# Altium project ATM90E3x-DB.PrjPcb
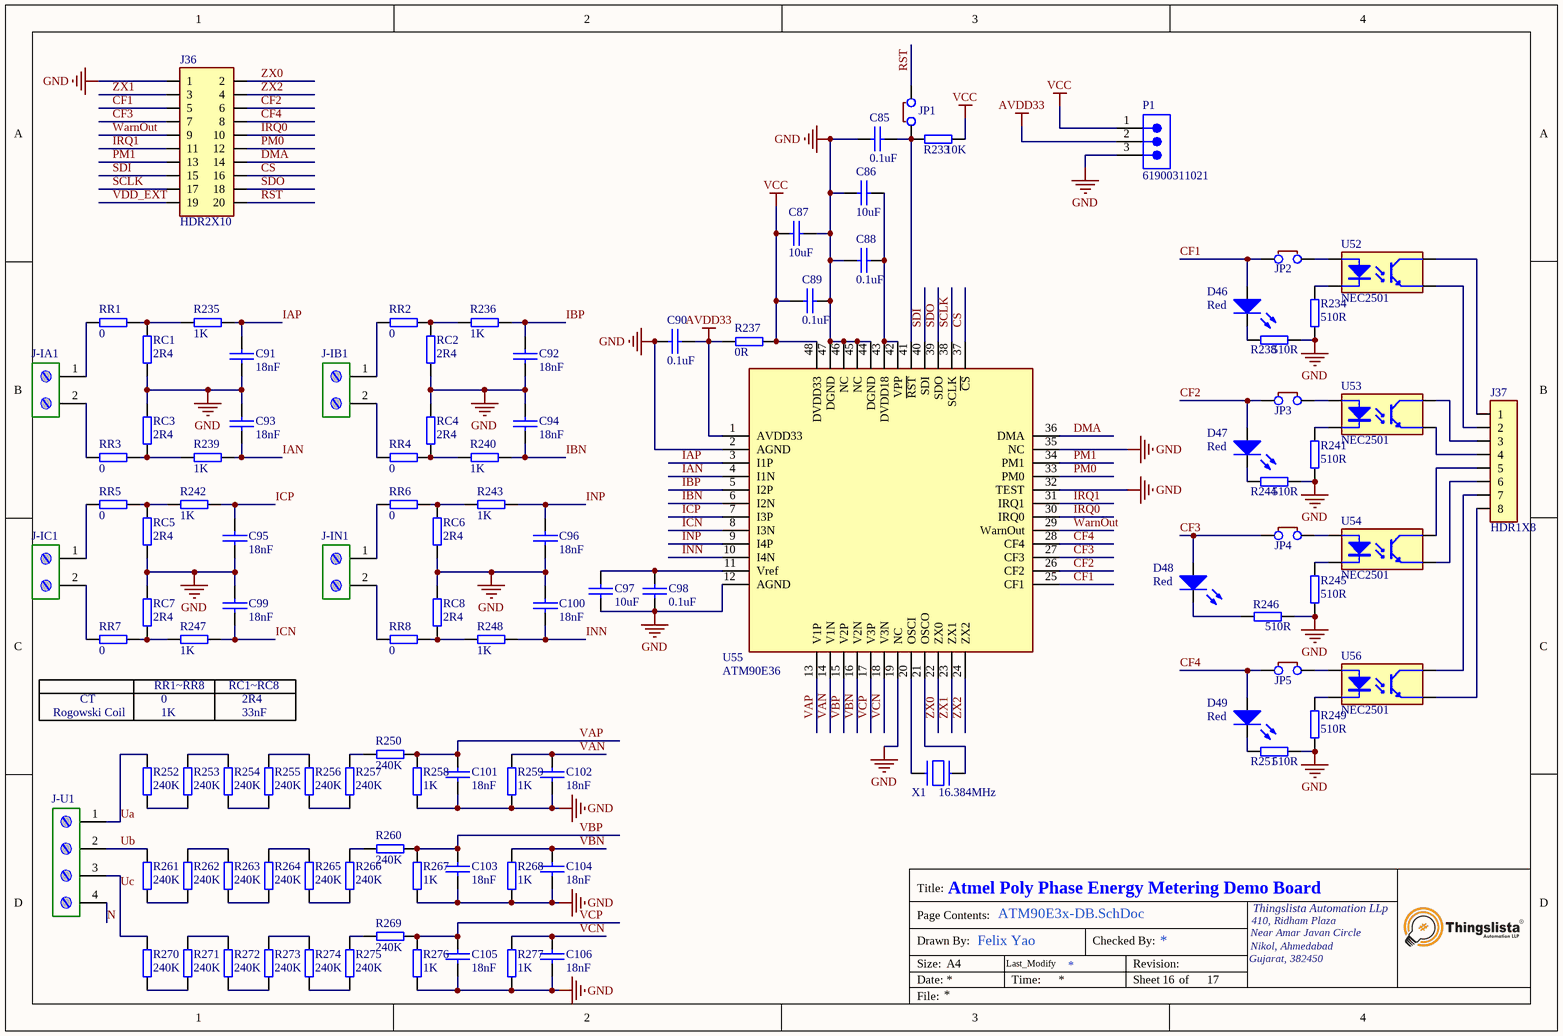
[diagram p0: ATM90E3x-DB.SchDoc]
1 sheet, 106 parts. Net scope: global (net labels, ports and power ports of the same name join across sheets).
Board file: ATM90E3x-DB.PcbDoc

## Sheet ATM90E3x-DB.SchDoc: Atmel Poly Phase Energy Metering Demo Board
size A4; DrawnBy: Felix Yao; Organization: Smart Energy; Revision: 1.0; SheetNumber: 16; SheetTotal: 17; PageSetup: Record=PageOptions|CenterHorizontal=True|CenterVertical=True|PrintScale=0.71|XCorrection=1.00|YCorrection=1.00|PrintKind=1|BorderSize=5000000|LeftOffset=0|BottomOffset=0|Orientation=2|PaperLength=2969|PaperWidth=2100|Scale=100|PaperSource=7|PrintQuality=600|MediaType=1|DitherType=10|PaperKind=A4 (210 x 297 mm)|PrintScaleMode=1

### Parts
C85  0.1uF  [C0603]
C86  10uF  [C0805]
C87  10uF  [C0805]
C88  0.1uF  [C0603]
C89  0.1uF  [C0603]
C90  0.1uF  [C0603]
C91  18nF  [C0805]
C92  18nF  [C0805]
C93  18nF  [C0805]
C94  18nF  [C0805]
C95  18nF  [C0805]
C96  18nF  [C0805]
C97  10uF  [C0805]
C98  0.1uF  [C0603]
C99  18nF  [C0805]
C100  18nF  [C0805]
C101  18nF  [C0805]
C102  18nF  [C0805]
C103  18nF  [C0805]
C104  18nF  [C0805]
C105  18nF  [C0805]
C106  18nF  [C0805]
D46  Red  [LED-0805R]
D47  Red  [LED-0805R]
D48  Red  [LED-0805R]
D49  Red  [LED-0805R]
J36  HDR2X10  [HDR2X10]
J37  HDR1X8  [HDR1X8]
J-IA1  (no value)  [TE-1776119-2]
J-IB1  (no value)  [TE-1776119-2]
J-IC1  (no value)  [TE-1776119-2]
J-IN1  (no value)  [TE-1776119-2]
J-U1  (no value)  [TE-282843-4]
JP1  JMP  [JMP]  (value not drawn)
JP2  JMP  [JMP]  (value not drawn)
JP3  JMP  [JMP]  (value not drawn)
JP4  JMP  [JMP]  (value not drawn)
JP5  JMP  [JMP]  (value not drawn)
P1  61900311021  [61900311021]
R233  10K  [R0603]
R234  510R  [R0805]
R235  1K  [R0805]
R236  1K  [R0805]
R237  0R  [R0603]
R238  510R  [R0805]
R239  1K  [R0805]
R240  1K  [R0805]
R241  510R  [R0805]
R242  1K  [R0805]
R243  1K  [R0805]
R244  510R  [R0805]
R245  510R  [R0805]
R246  510R  [R0805]
R247  1K  [R0805]
R248  1K  [R0805]
R249  510R  [R0805]
R250  240K  [R1206]
R251  510R  [R0805]
R252  240K  [R1206]
R253  240K  [R1206]
R254  240K  [R1206]
R255  240K  [R1206]
R256  240K  [R1206]
R257  240K  [R1206]
R258  1K  [R0805]
R259  1K  [R0805]
R260  240K  [R1206]
R261  240K  [R1206]
R262  240K  [R1206]
R263  240K  [R1206]
R264  240K  [R1206]
R265  240K  [R1206]
R266  240K  [R1206]
R267  1K  [R0805]
R268  1K  [R0805]
R269  240K  [R1206]
R270  240K  [R1206]
R271  240K  [R1206]
R272  240K  [R1206]
R273  240K  [R1206]
R274  240K  [R1206]
R275  240K  [R1206]
R276  1K  [R0805]
R277  1K  [R0805]
RC1  2R4  [R0805]
RC2  2R4  [R0805]
RC3  2R4  [R0805]
RC4  2R4  [R0805]
RC5  2R4  [R0805]
RC6  2R4  [R0805]
RC7  2R4  [R0805]
RC8  2R4  [R0805]
RR1  0  [R0805]
RR2  0  [R0805]
RR3  0  [R0805]
RR4  0  [R0805]
RR5  0  [R0805]
RR6  0  [R0805]
RR7  0  [R0805]
RR8  0  [R0805]
U52  NEC2501  [PS2501L-1]
U53  NEC2501  [PS2501L-1]
U54  NEC2501  [PS2501L-1]
U55  ATM90E36  [TQFP-48(7x7)]
U56  NEC2501  [PS2501L-1]
X1  16.384MHz  [XTAL-MIX-49]

### Nets
AVDD33: C90.2 P1.2 R237.2 U55.1(AVDD33)
GND: C85.1 C86.2 C87.1 C88.1 C89.2 C90.1 C91.1 C92.2 C93.2 C94.1 C95.2 C96.2 C97.1 C98.1 C99.1 C100.1 C101.1 C102.1 C103.1 C104.1 C105.1 C106.1 J36.1 P1.3 R234.1 R238.1 R241.1 R244.1 R245.1 R246.1 R249.1 R251.1 R258.1 R259.1 R267.1 R268.1 R276.1 R277.1 RC1.1 RC2.1 RC3.2 RC4.2 RC5.1 RC6.1 RC7.2 RC8.2 U55.2(AGND) U55.12(AGND) U55.19(NC) U55.32(TEST) U55.35(NC) U55.44(DGND) U55.45(NC) U55.46(NC) U55.47(DGND)
VCC: C87.2 C89.1 P1.1 R233.2 R237.1 U55.48(DVDD33)
CF1: D46.A J36.5 JP2.1 U55.25(CF1)
CF2: D47.A J36.6 JP3.1 U55.26(CF2)
CF3: D48.A J36.7 JP4.1 U55.27(CF3)
CF4: D49.A J36.8 JP5.1 U55.28(CF4)
CS: J36.16 U55.37(~{CS})
DMA: J36.14 U55.36(DMA)
IAN: C93.1 R239.1 U55.4(I1N)
IAP: C91.2 R235.1 U55.3(I1P)
IBN: C94.2 R240.2 U55.6(I2N)
IBP: C92.1 R236.2 U55.5(I2P)
ICN: C99.2 R247.2 U55.8(I3N)
ICP: C95.1 R242.2 U55.7(I3P)
INN: C100.2 R248.2 U55.10(I4N)
INP: C96.1 R243.2 U55.9(I4P)
IRQ0: J36.10 U55.30(IRQ0)
IRQ1: J36.11 U55.31(IRQ1)
N: J-U1.4
PM0: J36.12 U55.33(PM0)
PM1: J36.13 U55.34(PM1)
RST: J36.20 JP1.2
SCLK: J36.17 U55.38(SCLK)
SDI: J36.15 U55.40(SDI)
SDO: J36.18 U55.39(SDO)
Ua: J-U1.1 R252.1
Ub: J-U1.2 R261.2
Uc: J-U1.3 R270.2
VAN: C102.2 R259.2 U55.14(V1N)
VAP: C101.2 R250.2 R258.2 U55.13(V1P)
VBN: C104.2 R268.2 U55.16(V2N)
VBP: C103.2 R260.1 R267.2 U55.15(V2P)
VCN: C106.2 R277.2 U55.18(V3N)
VCP: C105.2 R269.1 R276.2 U55.17(V3P)
VDD_EXT: J36.19
WarnOut: J36.9 U55.29(WarnOut)
ZX0: J36.2 U55.22(ZX0)
ZX1: J36.3 U55.23(ZX1)
ZX2: J36.4 U55.24(ZX2)
NetC85_2: C85.2 JP1.1 R233.1 U55.41(~{RST})
NetC86_1: C86.1 C88.2 U55.42(VPP) U55.43(DVDD18)
NetC97_2: C97.2 C98.2 U55.11(Vref)
NetD46_K: D46.K R238.2
NetD47_K: D47.K R244.2
NetD48_K: D48.K R246.2
NetD49_K: D49.K R251.2
NetJ37_1: J37.1 U52.4(C)
NetJ37_2: J37.2 U52.3(E)
NetJ37_3: J37.3 U53.4(C)
NetJ37_4: J37.4 U53.3(E)
NetJ37_5: J37.5 U54.4(C)
NetJ37_6: J37.6 U54.3(E)
NetJ37_7: J37.7 U56.4(C)
NetJ37_8: J37.8 U56.3(E)
NetJ-IA1_1: J-IA1.1 RR1.2
NetJ-IA1_2: J-IA1.2 RR3.2
NetJ-IB1_1: J-IB1.1 RR2.2
NetJ-IB1_2: J-IB1.2 RR4.2
NetJ-IC1_1: J-IC1.1 RR5.2
NetJ-IC1_2: J-IC1.2 RR7.2
NetJ-IN1_1: J-IN1.1 RR6.2
NetJ-IN1_2: J-IN1.2 RR8.2
NetJP2_2: JP2.2 U52.1(A)
NetJP3_2: JP3.2 U53.1(A)
NetJP4_2: JP4.2 U54.1(A)
NetJP5_2: JP5.2 U56.1(A)
NetR234_2: R234.2 U52.2(K)
NetR235_2: R235.2 RC1.2 RR1.1
NetR236_1: R236.1 RC2.2 RR2.1
NetR239_2: R239.2 RC3.1 RR3.1
NetR240_1: R240.1 RC4.1 RR4.1
NetR241_2: R241.2 U53.2(K)
NetR242_1: R242.1 RC5.2 RR5.1
NetR243_1: R243.1 RC6.2 RR6.1
NetR245_2: R245.2 U54.2(K)
NetR247_1: R247.1 RC7.1 RR7.1
NetR248_1: R248.1 RC8.1 RR8.1
NetR249_2: R249.2 U56.2(K)
NetR250_1: R250.1 R257.1
NetR252_2: R252.2 R253.2
NetR253_1: R253.1 R254.1
NetR254_2: R254.2 R255.2
NetR255_1: R255.1 R256.1
NetR256_2: R256.2 R257.2
NetR260_2: R260.2 R266.2
NetR261_1: R261.1 R262.1
NetR262_2: R262.2 R263.2
NetR263_1: R263.1 R264.1
NetR264_2: R264.2 R265.2
NetR265_1: R265.1 R266.1
NetR269_2: R269.2 R275.2
NetR270_1: R270.1 R271.1
NetR271_2: R271.2 R272.2
NetR272_1: R272.1 R273.1
NetR273_2: R273.2 R274.2
NetR274_1: R274.1 R275.1
NetU55_20: U55.20(OSCI) X1.2
NetU55_21: U55.21(OSCO) X1.1

### Notes on the sheet
- Rogowski Coil
- CT
- RR1~RR8
- 0
- 1K
- RC1~RC8
- 2R4
- 33nF
- Title:
- Page Contents:
- 410, Ridham Plaza
- Thingslista Automation LLp
- Size:
- Date:
- File:
- Drawn By:
- A4
- Last_Modify
- Time:
- Checked By:
- Revision:
- Sheet
- of
- Gujarat, 382450
- Near Amar Javan Circle
- Nikol, Ahmedabad

### Library data of the parts
C85-C106 = CAP
D46-D49 = LED
J-IA1 J-IB1 J-IC1 J-IN1 = Terminal-Screw-2
J-U1 = Terminal-Screw-4
P1 = CMP-1502-00593-2: NexarPartId: 18818221; Number of Positions: 3; Voltage Rating: 250V; Current Rating: 3A; Connector Type: Male Pin; Contact Resistance: 20mΩ; Insulation: Insulated; Insulation Resistance: 1GΩ; Gender: Male; Pitch: 2.54mm; Contact Gender: Male; Color: Beige; Termination: Through Hole; Height: 3.3mm; Max Operating Temperature: 105°C; Min Operating Temperature: -40°C; Mount: Through Hole; Contact Material: Copper; Operating Supply Voltage: 250V; RoHS: Compliant; Lead Pitch: 2.54mm; Contact Mating Length: 7.62mm; Contact Plating: Tin; Number of Contacts: 3; Fastening Type: Friction; Flammability Rating: UL94 V-0; Packaging: Bulk; Number of Pins: 3; Number of Rows: 1; Width: 7.66mm; Housing Material: Nylon; REACH SVHC: Unknown; Length: 7.62mm
R233-R277 RC1-RC8 RR1-RR8 = RES
U55 = ATM90E3X
X1 = XTAL-T